# EAGLE design VFD PSU V2 (EAGLE 9.4.1)
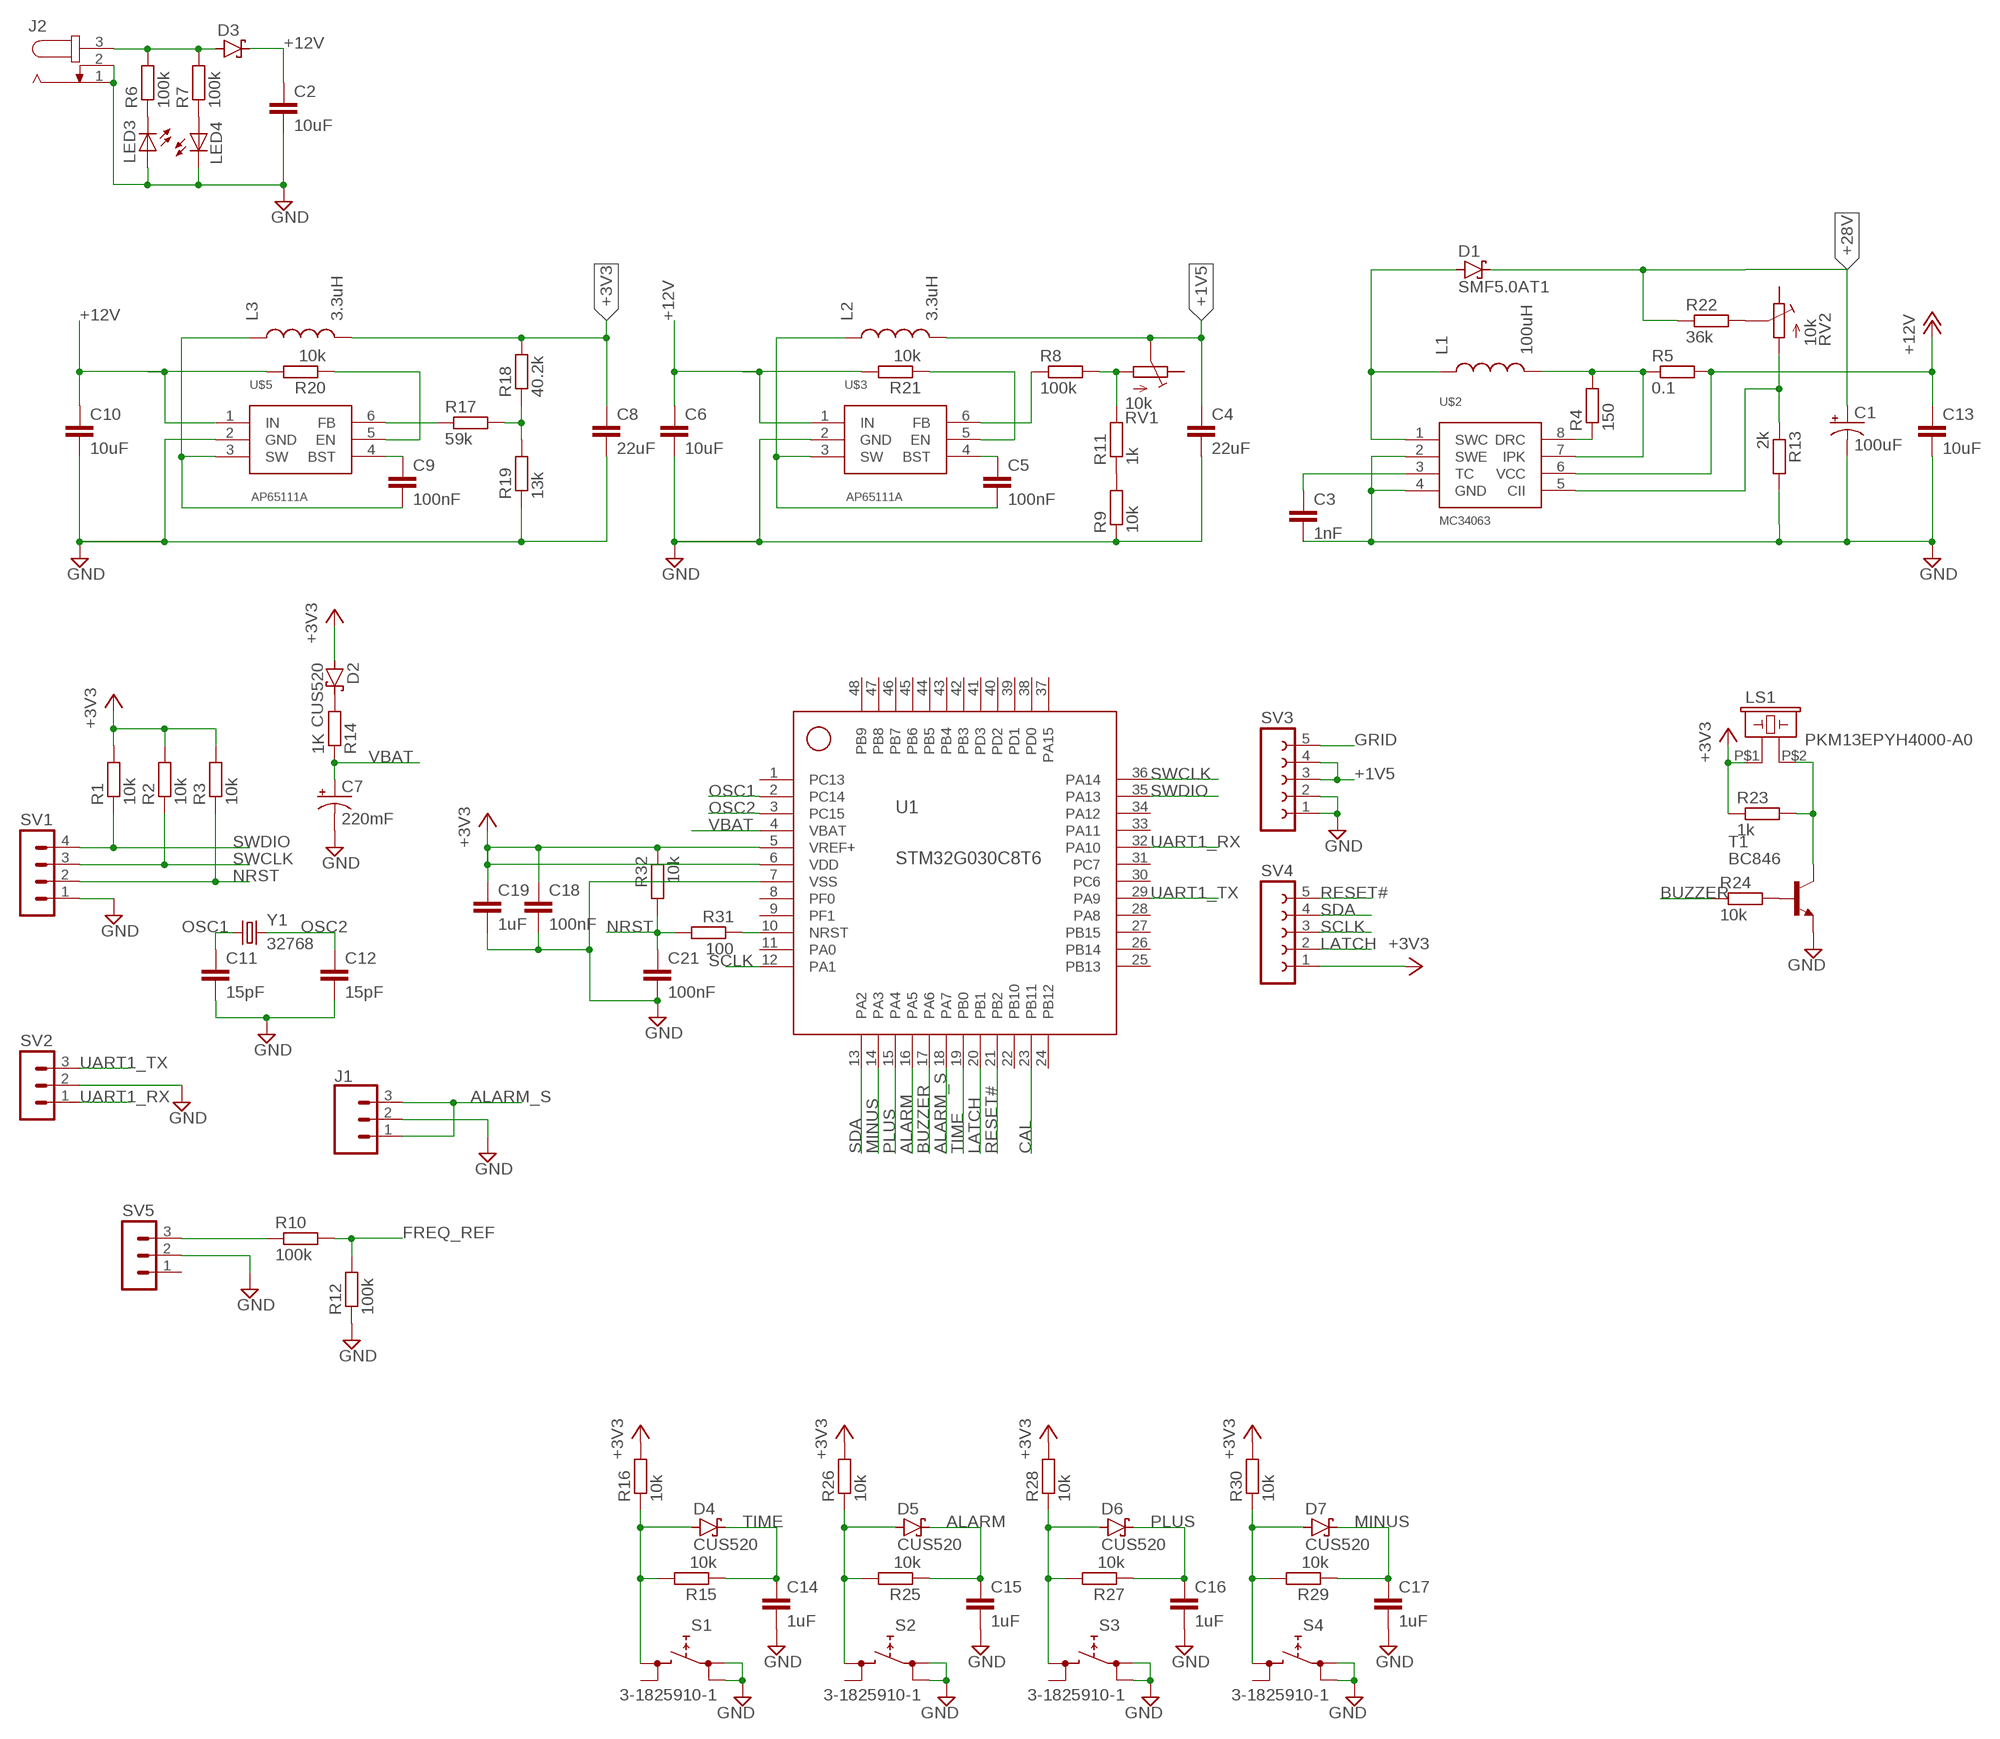
[diagram p0: schematic, sheet 1]

## Parts
C1  100uF  22UF-POLAR-PANASONIC_C-35V-20%  [PANASONIC_C]
C2  10uF  C-EUC0805  [C0805]
C3  1nF  C-EUC0603  [C0603]
C4  22uF  C-EUC0805  [C0805]
C5  100nF  C-EUC0603  [C0603]
C6  10uF  C-EUC0805  [C0805]
C7  220mF  DSK-3R3H224U-HL  [4.8-COINCELL-SCAP]
C8  22uF  C-EUC0805  [C0805]
C9  100nF  C-EUC0603  [C0603]
C10  10uF  C-EUC0805  [C0805]
C11  15pF  C-EUC0402  [C0402]
C12  15pF  C-EUC0402  [C0402]
C13  10uF  C-EUC0805  [C0805]
C14  1uF  C-EUC0603  [C0603]
C15  1uF  C-EUC0603  [C0603]
C16  1uF  C-EUC0603  [C0603]
C17  1uF  C-EUC0603  [C0603]
C18  100nF  C-EUC0603  [C0603]
C19  1uF  C-EUC0603  [C0603]
C21  100nF  C-EUC0603  [C0603]
D1  SMF5.0AT1  [SOD123FL]
D2  CUS520  BAT60J  [SOD323_ST]
D3  SCHOTTKY-DIODESMD  [SMB]
D4  CUS520  BAT60J  [SOD323_ST]
D5  CUS520  BAT60J  [SOD323_ST]
D6  CUS520  BAT60J  [SOD323_ST]
D7  CUS520  BAT60J  [SOD323_ST]
J1  CONN_03JST-PTH-NS  [JST-3-PTH-NS]
J2  JACK-PLUG0  [SPC4077]
L1  100uH  ETQ-P5M101YGK  [2-SMD]
L2  3.3uH  L1008  [1008]
L3  3.3uH  L1008  [1008]
LED3  LEDSMT1206  [1206]
LED4  LEDSMT1206  [1206]
LS1  PKM13EPYH4000-A0  [PKM13EPYH4000-A0]
R1  10k  R-EU_R0603  [R0603]
R2  10k  R-EU_R0603  [R0603]
R3  10k  R-EU_R0603  [R0603]
R4  150  R-EU_R0603  [R0603]
R5  0.1  R-EU_R0805  [R0805]
R6  100k  R-EU_R0603  [R0603]
R7  100k  R-EU_R0603  [R0603]
R8  100k  R-EU_R0603  [R0603]
R9  10k  R-EU_R0603  [R0603]
R10  100k  R-EU_R0603  [R0603]
R11  1k  R-EU_R0603  [R0603]
R12  100k  R-EU_R0603  [R0603]
R13  2k  R-EU_R0603  [R0603]
R14  1K  R-EU_R0603  [R0603]
R15  10k  R-EU_R0603  [R0603]
R16  10k  R-EU_R0603  [R0603]
R17  59k  R-EU_R0603  [R0603]
R18  40.2k  R-EU_R0603  [R0603]
R19  13k  R-EU_R0603  [R0603]
R20  10k  R-EU_R0603  [R0603]
R21  10k  R-EU_R0603  [R0603]
R22  36k  R-EU_R0603  [R0603]
R23  1k  R-EU_R0603  [R0603]
R24  10k  R-EU_R0603  [R0603]
R25  10k  R-EU_R0603  [R0603]
R26  10k  R-EU_R0603  [R0603]
R27  10k  R-EU_R0603  [R0603]
R28  10k  R-EU_R0603  [R0603]
R29  10k  R-EU_R0603  [R0603]
R30  10k  R-EU_R0603  [R0603]
R31  100  R-EU_R0603  [R0603]
R32  10k  R-EU_R0603  [R0603]
RV1  10k  TC33X-2  [TC33X-2]
RV2  10k  TC33X-2  [TC33X-2]
S1  3-1825910-1  PANASONICSWITCH  [PANASONISWITCH]
S2  3-1825910-1  PANASONICSWITCH  [PANASONISWITCH]
S3  3-1825910-1  PANASONICSWITCH  [PANASONISWITCH]
S4  3-1825910-1  PANASONICSWITCH  [PANASONISWITCH]
SV1  MA04-1  [MA04-1]
SV2  MA03-1  [MA03-1]
SV3  FE05W  [FE05W]
SV4  FE05W  [FE05W]
SV5  MA03-1  [MA03-1]
T1  BC846  [SOT23]
U1  STM32G030C8T6  [LQFP48]
U$2  MC34063  [SO08]
U$3  AP65111A  [TSOT23-6]
U$5  AP65111A  [TSOT23-6]
Y1  32768  FC-135  [2-SMD-NO-LEAD-Q]

## Nets
+1V5: C4.1 L2.P$2 RV1.P$2(S) SV3.3 SV3.4
+3V3: C8.1 C18.1 C19.1 D2.A L3.P$2 LS1.P$1 R1.2 R2.2 R3.2 R16.2 R18.2 R23.1 R26.2 R28.2 R30.2 R32.1 SV4.1 U1.5(VREF+) U1.6(VDD)
+12V: C2.1 C6.1 C10.1 C13.1 D3.C R5.2 R20.2 R21.2 U$2.6(VCC) U$3.1(IN) U$5.1(IN)
+28V: C1.+ D1.C R22.1
ALARM: C15.1 D5.C R25.1 U1.16(PA5)
ALARM_S: J1.1 J1.3 U1.18(PA7)
BUZZER: R24.1 U1.17(PA6)
CAL: U1.23(PB11)
FREQ_REF: R10.2 R12.2
GND: C1.- C2.2 C3.2 C4.2 C6.2 C7.P$2(-) C8.2 C10.2 C11.2 C12.2 C13.2 C14.2 C15.2 C16.2 C17.2 C18.2 C19.2 C21.2 J1.2 J2.1 J2.2 LED3.A LED4.C R9.1 R12.1 R13.2 R19.1 S1.P$1 S1.P$2 S2.P$1 S2.P$2 S3.P$1 S3.P$2 S4.P$1 S4.P$2 SV1.1 SV2.2 SV3.1 SV3.2 SV5.2 T1.2(E) U1.7(VSS) U$2.2(SWE) U$2.4(GND) U$3.2(GND) U$5.2(GND)
GRID: SV3.5
LATCH: SV4.2 U1.20(PB1)
MINUS: C17.1 D7.C R29.1 U1.14(PA3)
N$1: LED3.C R6.1
N$2: LED4.A R7.1
N$3: R9.2 R11.1
N$4: R8.1 U$3.6(FB)
N$5: L1.P$2 R4.2 R5.1 U$2.7(IPK)
N$6: D3.A J2.3 R6.2 R7.2
N$7: R4.1 U$2.8(DRC)
N$8: R21.1 U$3.5(EN)
N$9: C5.2 L2.P$1 U$3.3(SW)
N$10: C5.1 U$3.4(BST)
N$11: R8.2 R11.2 RV1.P$1(E)
N$12: D1.A L1.P$1 U$2.1(SWC)
N$13: R22.2 RV2.P$2(S)
N$14: C3.1 U$2.3(TC)
N$15: R10.1 SV5.3
N$16: R20.1 U$5.5(EN)
N$17: C9.2 L3.P$1 U$5.3(SW)
N$18: C9.1 U$5.4(BST)
N$19: D4.A R15.2 R16.1 S1.P$3
N$20: R17.1 U$5.6(FB)
N$21: R17.2 R18.1 R19.2
N$22: R13.1 RV2.P$1(E) U$2.5(CII)
N$23: D2.C R14.2
N$25: LS1.P$2 R23.2 T1.3(C)
N$26: R24.2 T1.1(B)
N$27: D5.A R25.2 R26.1 S2.P$3
N$28: R31.1 U1.10(NRST)
N$29: D6.A R27.2 R28.1 S3.P$3
N$31: D7.A R29.2 R30.1 S4.P$3
NRST: C21.1 R3.1 R31.2 R32.2 SV1.2
OSC1: C11.1 U1.2(PC14) Y1.P$1
OSC2: C12.1 U1.3(PC15) Y1.P$2
PLUS: C16.1 D6.C R27.1 U1.15(PA4)
RESET#: SV4.5 U1.21(PB2)
SCLK: SV4.3 U1.12(PA1)
SDA: SV4.4 U1.13(PA2)
SWCLK: R2.1 SV1.3 U1.36(PA14)
SWDIO: R1.1 SV1.4 U1.35(PA13)
TIME: C14.1 D4.C R15.1 U1.19(PB0)
UART1_RX: SV2.1 U1.32(PA10)
UART1_TX: SV2.3 U1.29(PA9)
VBAT: C7.P$1(+) R14.1 U1.4(VBAT)
Unconnected: RV1.P$3(A) RV2.P$3(A) S1.P$4 S2.P$4 S3.P$4 S4.P$4 SV5.1 U1.1(PC13) U1.8(PF0) U1.9(PF1) U1.11(PA0) U1.22(PB10) U1.24(PB12) U1.25(PB13) U1.26(PB14) U1.27(PB15) U1.28(PA8) U1.30(PC6) U1.31(PC7) U1.33(PA11) U1.34(PA12) U1.37(PA15) U1.38(PD0) U1.39(PD1) U1.40(PD2) U1.41(PD3) U1.42(PB3) U1.43(PB4) U1.44(PB5) U1.45(PB6) U1.46(PB7) U1.47(PB8) U1.48(PB9)

## Library data of the parts
C1 = SparkFun-Capacitors:22UF-POLAR: 22µF polarized capacitors A capacitor is a passive two-terminal electrical component used to store electrical energy temporarily in an electric field.; PROD_ID: CAP-08618; VALUE: 22uF
C2-C6 C8-C10 C13-C19 C21 = rcl:C-EU: CAPACITOR, European symbol; SPICEPREFIX: C
C7 = Mason-Passives:DSK-3R3H224U-HL: A 220mF coin cell super capacitor, rated at 3.3v
C11 C12 = resistor:C-EU: CAPACITOR, European symbol
D1 = diode:SMF5.0AT1: 200 W Transient Voltage Suppressor Source: Data sheet <http://www.onsemi.com/pub_link/Collateral/SMF5.0AT1-D.PDF>
D2 D4-D7 = diode:BAT60J: Schottky barrier diode Source: www.st.com, BAT60J.pdf
D3 = diode:SCHOTTKY-DIODE: Schottky Diode
J1 = SparkFun-Connectors:CONN_03: Multi connection point. Often used as Generic Header-pin footprint for 0.1 inch spaced/style header connections On any of the 0.1 inch spaced packages, you can populate with these: Break Away Headers - Straight <https://www.sparkfun.com/products/116> (PRT-00116) Break Away Male Headers - Right Angle <https://www.sparkfun.com/products/553> (PRT-00553) Female Headers <https://www.sparkfun.com/products/115> (PRT-00115) Break Away Headers - Machine Pin <https://www.sparkfun.com/products/117> (PRT-00117) Break Away Female Headers - Swiss Machine Pin <https://www.sparkfun.com/products/743> (PRT-00743) Stackable Header - 3 Pin (Female, 0.1") <https://www.sparkfun.com/products/13875> (PRT-13875) For SCREWTERMINALS and SPRING TERMINALS visit here: Screw Terimnals on SparkFun.com <https://www.sparkfun.com/search/results?term=Screw+Terminals> (5mm/3.5mm/2.54mm spacing) This device is also useful as a general connection point to wire up your design to another part of your project. Our various solder wires solder well into these plated through hole pads. Hook-Up Wire - Assortment (Stranded, 22 AWG) <https://www.sparkfun.com/products/11375> (PRT-11375) Hook-Up Wire - Assortment (Solid Core, 22 AWG) <https://www.sparkfun.com/products/11367> (PRT-11367) View the entire wire category on our website here <https://www.sparkfun.com/categories/141> Special notes: Molex polarized connector foot print use with SKU : PRT-08232 with associated crimp pins and housings.
J2 = con-jack:JACK-PLUG: DC POWER JACK Power Jack, DC, Right Angle, Through Hole, Rated 5A at 16VDC, PC Terminals Distributor: Farnell (www.Farnell.de) Drawing: 84N1161.pdf / 84N1162.pdf Manufacturer: SPC Technology (www.spctechnology.com) Type: SPC4077 / SPC 4078; OC_FARNELL: unknown; OC_NEWARK: unknown
L1 = Mason-Passives:ETQ-P5M101YGK: 100uH j-lead surface mount inductor manufactured by panasonic
L2 = VFD:L1008
L3 = Mason-Passives:L1008
LED3 LED4 = led:LED: LED OSRAM: - CHIPLED LG R971, LG N971, LY N971, LG Q971, LY Q971, LO R971, LY R971 LH N974, LH R974 LS Q976, LO Q976, LY Q976 LO Q996 - Hyper CHIPLED LW Q18S LB Q993, LB Q99A, LB R99A - SideLED LS A670, LO A670, LY A670, LG A670, LP A670 LB A673, LV A673, LT A673, LW A673 LH A674 LY A675 LS A676, LA A676, LO A676, LY A676, LW A676 LS A679, LY A679, LG A679 - Hyper Micro SIDELED® LS Y876, LA Y876, LO Y876, LY Y876 LT Y87S - SmartLED LW L88C, LW L88S LB L89C, LB L89S, LG L890 LS L89K, LO L89K, LY L89K LS L896, LA L896, LO L896, LY L896 - TOPLED LS T670, LO T670, LY T670, LG T670, LP T670 LSG T670, LSP T670, LSY T670, LOP T670, LYG T670 LG T671, LOG T671, LSG T671 LB T673, LV T673, LT T673, LW T673 LH T674 LS T676, LA T676, LO T676, LY T676, LB T676, LH T676, LSB T676, LW T676 LB T67C, LV T67C, LT T67C, LS T67K, LO T67K, LY T67K, LW E67C LS E67B, LA E67B, LO E67B, LY E67B, LB E67C, LV E67C, LT E67C LW T67C LS T679, LY T679, LG T679 LS T770, LO T770, LY T770, LG T770, LP T770 LB T773, LV T773, LT T773, LW T773 LH T774 LS E675, LA E675, LY E675, LS T675 LS T776, LA T776, LO T776, LY T776, LB T776 LHGB T686 LT T68C, LB T68C - Hyper Mini TOPLED® LB M676 - Mini TOPLED Santana® LG M470 LS M47K, LO M47K, LY M47K Source: http://www.osram.convergy.de LUXEON: - LUMILED® LXK2-PW12-R00, LXK2-PW12-S00, LXK2-PW14-U00, LXK2-PW14-V00 LXK2-PM12-R00, LXK2-PM12-S00, LXK2-PM14-U00 LXK2-PE12-Q00, LXK2-PE12-R00, LXK2-PE12-S00, LXK2-PE14-T00, LXK2-PE14-U00 LXK2-PB12-K00, LXK2-PB12-L00, LXK2-PB12-M00, LXK2-PB14-N00, LXK2-PB14-P00, LXK2-PB14-Q00 LXK2-PR12-L00, LXK2-PR12-M00, LXK2-PR14-Q00, LXK2-PR14-R00 LXK2-PD12-Q00, LXK2-PD12-R00, LXK2-PD12-S00 LXK2-PH12-R00, LXK2-PH12-S00 LXK2-PL12-P00, LXK2-PL12-Q00, LXK2-PL12-R00 Source: www.luxeon.com KINGBRIGHT: KA-3528ASYC Source: www.kingbright.com
LS1 = Mason-Misc:PKM13EPYH4000-A0
R1-R4 R6-R32 = resistor:R-EU_: RESISTOR, European symbol
R5 = rcl:R-EU_: RESISTOR, European symbol; SPICEPREFIX: R
RV1 RV2 = Mason-Passives:TC33X-2
S1-S4 = Mason-Misc:PANASONICSWITCH
SV1 = con-lstb:MA04-1: PIN HEADER; OC_FARNELL: unknown; OC_NEWARK: unknown
SV2 SV5 = con-lstb:MA03-1: PIN HEADER; OC_FARNELL: unknown; OC_NEWARK: unknown
SV3 SV4 = con-lsta:FE05W: FEMALE HEADER; OC_FARNELL: unknown; OC_NEWARK: unknown
T1 = transistor:BC846: NPN TRANSISTOR
U1 = Mason-MCUs:STM32G030C8T6: A 32 bit STM microcontroller with integrated RTC
U$2 = Mason-Power:MC34063
U$3 = VFD:AP65111A: 18v 1.5A max buck converter manufactured by Diodes Incorporated
U$5 = Mason-Power:AP65111A: 18v 1.5A max buck converter manufactured by Diodes Incorporated
Y1 = Mason-Passives:FC-135: An Epson 2-SMD 20ppm quartz crystal

## Board
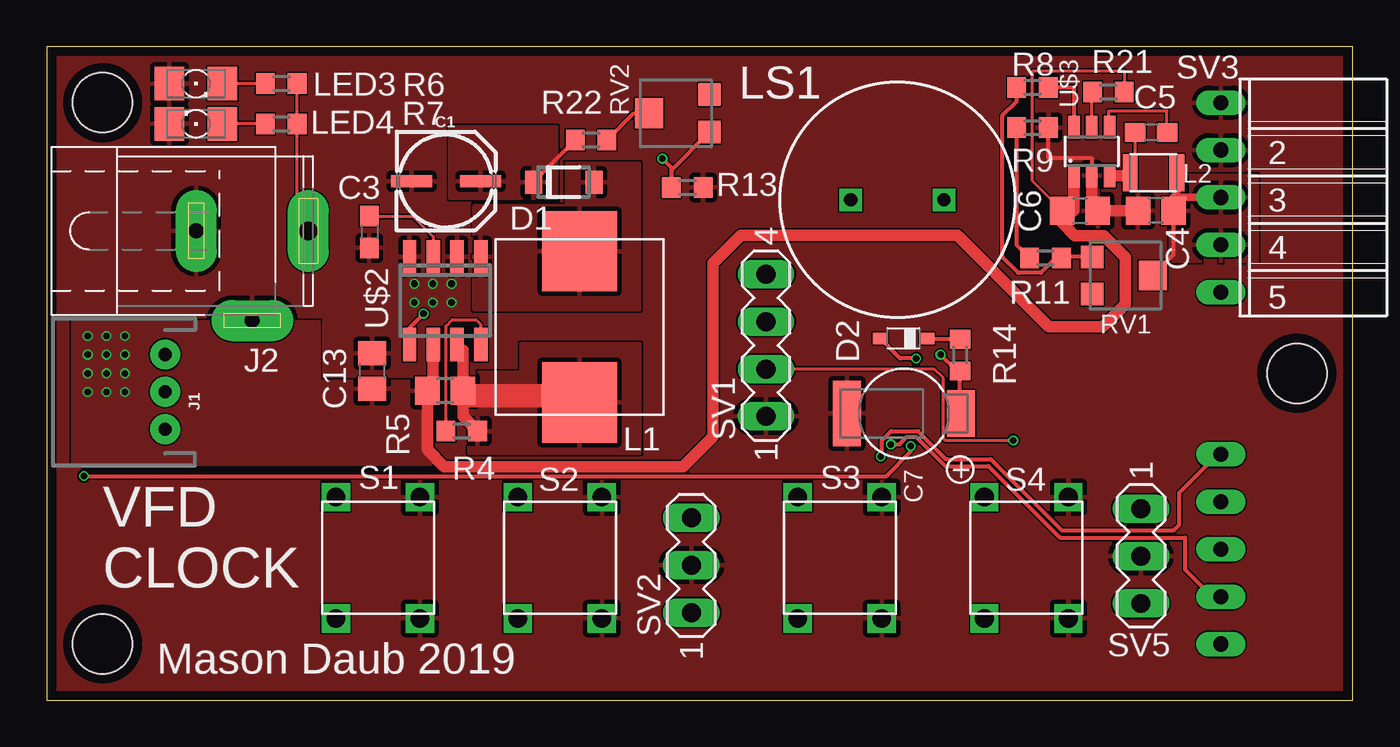
[diagram p1: board, top side]
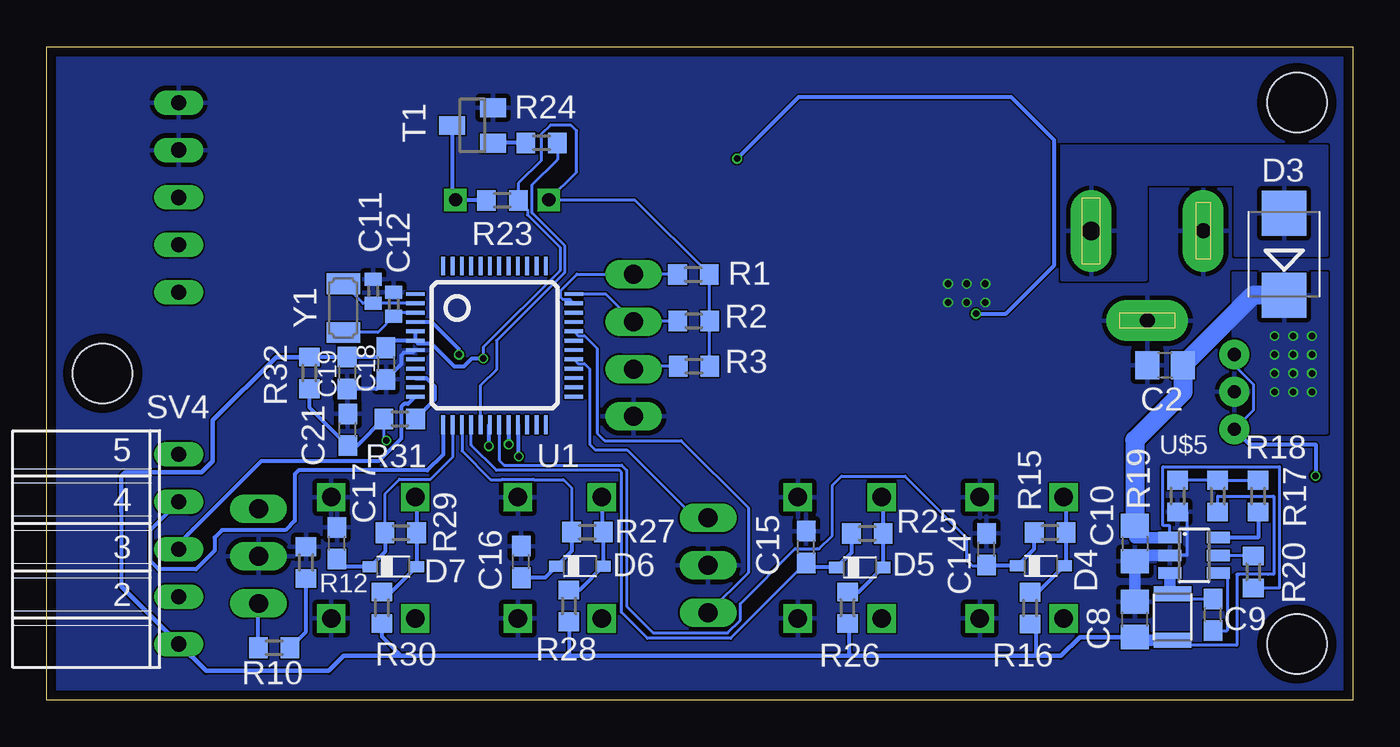
[diagram p2: board, bottom side, seen from below]

Size 70 x 35 mm. Coordinates in mm from the lower left corner, seen from the top.
Outline: 0,0 70,0 70,35 0,35 0,0
Copper layers (1*16): Top 0.035mm / dielectric 1.5mm / Bottom 0.035mm
Design rules "jlcpcb": minimum track width 3.5mil, minimum drill 0.35mm, track to track 3.5mil, track to pad 3.5mil, pad to pad 3.5mil, via to via 5mil, smd to smd 3.5mil, copper to edge 20mil, drill to drill 6mil, minimum pad ring 10mil, minimum via ring 3mil, stop-mask expansion 4mil, vias tented up to drill 0mil, thermal gap 10mil
Holes 3.2 mm at 3,32 3,3 67,17.5

### Footprints (pad centres in the part's own frame; a part is rotated, then mirrored left to right if it is on the bottom)
PANASONIC_C = smd 2.2 x 0.65: + 1.9,-0.2; - -1.8,-0.2
C0805 = smd 1.3 x 1.5: 1 -0.95,0; 2 0.95,0
C0603 = smd 1.1 x 1: 1 -0.85,0; 2 0.85,0
4.8-COINCELL-SCAP = smd 2.5 x 1.5: P$1 0,3.05 | smd 3.5 x 1.5: P$2 0,-3.05
C0402 = smd 0.7 x 0.9: 1 -0.65,0; 2 0.65,0
SOD123FL = smd 0.91 x 1.22: A 1.625,0; C -1.625,0
SOD323_ST = smd 0.8 x 0.6: A 1.25,0; C -1.25,0
SMB = smd 2.4 x 2.4: A 2.2,0; C -2.2,0
JST-3-PTH-NS = drill 0.7 pad 1.6: 1 -2,0; 2 0,0; 3 2,0
SPC4077 = drill 0.8 pad 2.184 long: 1 -3,0; 2 0,-4.8 | drill 1 pad 2.184 long: 3 3,0
2-SMD = smd 4.3 x 4: P$1 -4.05,0; P$2 4.05,0
1008 = smd 0.8 x 2: P$1 -1.25,0; P$2 1.25,0
1206 = smd 1.6 x 1.803: A -1.422,0; C 1.422,0
PKM13EPYH4000-A0 = drill 0.7 square: P$1 -2.5,0; P$2 2.5,0
R0603 = smd 1 x 1.1: 1 -0.85,0; 2 0.85,0
R0805 = smd 1.3 x 1.5: 1 -0.95,0; 2 0.95,0
TC33X-2 = smd 1.2 x 1.2: P$1 -1,-1.8; P$3 1,-1.8 | smd 1.6 x 1.5: P$2 0,1.45
PANASONISWITCH = drill 1 square: P$1 2.25,3.25; P$2 2.25,-3.25; P$3 -2.25,3.25; P$4 -2.25,-3.25
MA04-1 = drill 1.016 long: 1 -3.81,0; 2 -1.27,0; 3 1.27,0; 4 3.81,0
MA03-1 = drill 1.016 long: 1 -2.54,0; 2 0,0; 3 2.54,0
FE05W = drill 0.813 long: 1 -5.08,0; 2 -2.54,0; 3 0,0; 4 2.54,0; 5 5.08,0
SOT23 = smd 1 x 1.4: 1 -0.95,-1.1; 2 0.95,-1.1; 3 0,1.1
LQFP48 = smd 0.2 x 1: 1 -2.75,-4.25; 2 -2.25,-4.25; 3 -1.75,-4.25; 4 -1.25,-4.25; 5 -0.75,-4.25; 6 -0.25,-4.25; 7 0.25,-4.25; 8 0.75,-4.25; 9 1.25,-4.25; 10 1.75,-4.25; 11 2.25,-4.25; 12 2.75,-4.25; 25 2.75,4.25; 26 2.25,4.25; 27 1.75,4.25; 28 1.25,4.25; 29 0.75,4.25; 30 0.25,4.25; 31 -0.25,4.25; 32 -0.75,4.25; 33 -1.25,4.25; 34 -1.75,4.25; 35 -2.25,4.25; 36 -2.75,4.25 | smd 1 x 0.2: 13 4.25,-2.75; 14 4.25,-2.25; 15 4.25,-1.75; 16 4.25,-1.25; 17 4.25,-0.75; 18 4.25,-0.25; 19 4.25,0.25; 20 4.25,0.75; 21 4.25,1.25; 22 4.25,1.75; 23 4.25,2.25; 24 4.25,2.75; 37 -4.25,2.75; 38 -4.25,2.25; 39 -4.25,1.75; 40 -4.25,1.25; 41 -4.25,0.75; 42 -4.25,0.25; 43 -4.25,-0.25; 44 -4.25,-0.75; 45 -4.25,-1.25; 46 -4.25,-1.75; 47 -4.25,-2.25; 48 -4.25,-2.75
SO08 = smd 0.72 x 1.78: 1 -1.905,-2.35; 2 -0.635,-2.35; 3 0.635,-2.35; 4 1.905,-2.35; 5 1.905,2.35; 6 0.635,2.35; 7 -0.635,2.35; 8 -1.905,2.35
TSOT23-6 = smd 0.62 x 1.22: 1 -0.95,-1.3; 2 0,-1.3; 3 0.95,-1.3; 4 0.95,1.3; 5 0,1.3; 6 -0.95,1.3
2-SMD-NO-LEAD-Q = smd 1.1 x 1.8: P$1 -1.3,0; P$2 1.3,0

### Placement (x,y rotation side)
C1  21.36,28 0 top
C2  10.06,17.92 180 bottom
C3  17.29,25.07 270 top
C4  59.44,26.21 180 top
C5  59.19,30.41 180 top
C6  55.38,26.21 0 top
C7  45.95,15.35 270 top
C8  11.68,4.32 90 bottom
C9  7.49,4.57 90 bottom
C10  11.68,8.38 270 bottom
C11  52.5,21.9 90 bottom
C12  51.4,21.2 90 bottom
C13  17.45,17.62 90 top
C14  19.63,8.08 90 bottom
C15  29.3,8.2 90 bottom
C16  44.57,7.4 90 bottom
C17  54.44,8.4 90 bottom
C18  51.82,18.02 270 bottom
C19  53.9,17.52 270 bottom
C21  53.86,14.48 90 bottom
D1  27.71,27.74 0 top
D2  45.92,19.37 180 top
D3  3.68,23.88 90 bottom
D4  16.72,7.19 0 bottom
D5  26.42,7.1 0 bottom
D6  41.42,7.17 0 bottom
D7  51.42,7.14 0 bottom
J1  6.35,16.51 90 top
J2  11.02,25.13 0 top
L1  28.56,19.99 270 top
L2  59.31,28.25 0 top
L3  9.65,4.45 270 bottom
LED3  8,33.02 0 top
LED4  8,30.86 180 top
LS1  45.59,26.79 0 top
R1  35.34,22.8 0 bottom
R2  35.32,20.3 0 bottom
R3  35.31,17.88 0 bottom
R4  22.25,14.41 0 top
R5  21.36,16.57 180 top
R6  12.57,33.02 0 top
R7  12.57,30.86 0 top
R8  52.84,32.82 180 top
R9  52.84,30.66 180 top
R10  57.81,2.8 0 bottom
R11  53.53,23.68 0 top
R12  56.1,7.36 270 bottom
R13  34.33,27.46 0 top
R14  48.95,18.48 90 top
R15  16.22,8.97 0 bottom
R16  17.29,4.92 270 bottom
R17  5.08,10.92 90 bottom
R18  7.24,10.92 270 bottom
R19  9.4,10.92 90 bottom
R20  5.33,6.86 270 bottom
R21  56.9,32.56 0 top
R22  29.17,30 0 top
R23  45.58,26.77 180 bottom
R24  43.48,29.85 180 bottom
R25  26.02,8.92 0 bottom
R26  27.08,4.94 270 bottom
R27  41.02,8.99 0 bottom
R28  42.01,5.04 270 bottom
R29  51.02,8.96 0 bottom
R30  52.04,4.94 270 bottom
R31  51.08,15.06 180 bottom
R32  55.92,17.52 270 bottom
RV1  57.82,22.74 270 top
RV2  33.72,31.43 90 top
S1  17.75,7.62 0 top
S2  27.5,7.62 0 top
S3  42.5,7.62 0 top
S4  52.5,7.62 0 top
SV1  38.55,19 90 top
SV2  34.55,7.22 90 top
SV3  62.92,26.92 270 top
SV4  62.92,8.08 90 bottom
SV5  58.65,7.71 270 top
T1  47.18,30.78 90 bottom
U1  46,19 270 bottom
U$2  21.36,21.39 180 top
U$3  56.01,29.39 0 top
U$5  8.51,7.75 270 bottom
Y1  54.1,21 270 bottom

### Tracks (layer width: path | path; a pad name or v marks a point on that pad's centre or on a via)
+1V5
  Top 0.203: C4.1 60.39,23.86 RV1.P$2
  Top 0.406: L2.P$2 60.56,26.21 C4.1 60.39,26.92 SV3.3
  Top 0.61: C4.1 60.56,26.21
  pour Top: 64.9,28.1 60.6,28.1 60.2,28.1 60.2,23.5 64.9,23.5
+3V3  (via drill 0.35)
  Top 0.203: v46.6,18.3 45.74,18.3 D2.A
  Bottom 0.152: 6.11,6.74 4.55,6.74 4.55,6.73 4.24,6.73 4.24,10.92 7.24,10.92 R18.2 | 6.11,6.74 | R3.2 R2.2 34.47,22.78 R1.2 38.46,26.77 43.11,26.77 | LS1.P$1 41.6,28.28 41.6,30.5 41.9,30.8 43,30.8 43.5,30.3 43.5,28.9 44.73,27.67 R23.1 44.23,26.27 44.23,25.99 42.5,24.26 42.5,23 46.6,18.9 v46.6,18.3 | C8.1 11.68,3.19 | L3.P$2 9.38,2.92 6.22,2.92 6.22,6.73 6.11,6.73 6.11,6.74
  Bottom 0.203: U1.5 U1.6 | U1.6 51.44,19.25 C18.1 52.32,18.37 C19.1 R32.1 | 43.11,26.77 LS1.P$1 | R16.2 17,3.78 17,2.36 | R26.2 27,4.01 27,2.36 | R28.2 42,2.36 | R30.2 52.04,3.4 51,2.36 | U1.6 50.11,19.11 49.4,19.11 48.16,17.87 47.64,17.87 47.2,18.3 v46.6,18.3 | 66,10.08 66,6.1
  Bottom 0.254: C8.1 14.63,3.37 15.64,2.36 17,2.36 27,2.36 42,2.36 51,2.36 54.08,2.36 54.88,1.56 61.46,1.56 62.95,3.05 | R32.1 57.71,18.37 61.1,14.98 61.1,12.8 61.7,12.2 65.8,12.2 66,12 66,10.08 | 62.95,3.05 66,6.1 | SV4.1 62.92,3.02 62.95,3.05
  Bottom 0.61: 11.68,3.19 L3.P$2
+12V  (via drill 0.35)
  Top 0.152: C6.1 52.84,27.8 52.84,33.71 57.75,33.71 R21.2 | R5.2 20.72,16.88
  Top 0.61: U$3.1 55.06,26.21 C6.1 54.42,25.56 55.11,24.87 56.65,24.87 57.8,23.72 57.8,21.2 56.6,20 53.7,20 48.8,24.9 37.2,24.9 35.7,23.4 35.7,14.1 34.1,12.5 21.3,12.5 20.41,13.39 R5.2 | 20.72,16.88 U$2.6
  Bottom 0.152: 4.92,6.01 3.94,6.01 3.94,12.5 10.18,12.5 10.18,9.34 9.81,9.34 U$5.1 | 11.68,8.7 C10.1
  Bottom 0.203: R20.2 4.92,6.01
  Bottom 0.61: U$5.1 11.68,8.7
  Bottom 1.016: D3.C 5.36,21.68 C2.1 9.11,16.49 11.68,13.92 C10.1
  other vias: 2.2,19.5 3.2,19.5 4.2,19.5 2.2,18.5 3.2,18.5 4.2,18.5 4.2,17.5 3.2,17.5 2.2,17.5 4.2,16.5 3.2,16.5 2.2,16.5
  pour Top: 19.45,17.07 15.64,17.07 15.64,12.63 20.59,12.63 20.59,15.68
  pour Bottom: 6.4,22.9 1.4,22.9 1.4,14.3 6.4,14.3
  pour Top: 1.4,20.3 14.6,20.3 14.6,17.1 16.5,17.1 16.5,12.6 16.3,12.6 1.4,12.6
+28V
  Top 0.203: R22.1 26.08,27.76 D1.C
  pour Top: 26.82,26.85 21.61,26.85 21.61,28.88 21.61,30.73 23.5,30.73 27.33,30.73 27.33,26.85
ALARM
  Bottom 0.152: C15.1 33.35,3.3 37.8,3.3 39.2,4.7 39.2,12.2 39.3,12.3 45.9,12.3 47.25,13.65 U1.16
  Bottom 0.203: R25.1 26.87,7.9 D5.C 29.05,7.1 C15.1
ALARM_S  (via drill 0.35)
  Top 0.203: v2,12 45,12 46.3,13.3 v46.3,13.6
  Bottom 0.152: J1.3 6.35,17.93 5.35,16.93 5.35,15.51 J1.1
  Bottom 0.203: J1.1 5.54,13.7 2,13.7 v2,12 | v46.3,13.6 46.3,14.7 U1.18
BUZZER
  Bottom 0.152: U1.17 46.75,16.85 45.9,17.7 45.9,19.26 42.26,22.9 42.26,24.36 43.99,26.09 43.99,27.59 42.63,28.95 R24.1
FREQ_REF
  Bottom 0.203: R10.2 56.1,3.66 R12.2
GND  (via drill 0.35)
  Top 0.203: 56.01,27.74 56.01,29.01 53.69,29.01 R9.1
  Top 0.61: U$3.2 56.01,27.74 56.01,26.21 C6.2 C4.2
  Bottom 0.152: 8.89,10.07 8.89,7.75 10.16,7.75
  Bottom 0.203: U1.7 50.4,18.6 50.85,18.6 51,18.45 51,18 C18.2 52.32,16.67 C19.2
  Bottom 0.61: 11.68,7.75 10.16,7.75 | C10.2 C8.2
  other vias: 19.7,22.3 20.7,22.3 21.7,22.3 21.7,21.3 20.7,21.3 19.7,21.3
  pour Top: 20.85,28.38 20.85,27.11 22.37,25.58 22.37,21.64 22.25,21.52 20.09,21.52 18.69,20.12 18.69,17.71 15.37,17.71 15.37,28.38
  pour Top (rank 2): 0,35 70,35 70,-0.1 0.1,-0.1 0,-0.1
  pour Bottom (rank 2): 0,35 70,35 70,0 0,0
LATCH  (via drill 0.35)
  Top 0.203: v45.24,13.7 45.7,13.7 46.1,14.09 46.59,14.09 48.16,12.53 50.47,12.53 54.3,8.7 61,8.7 61,7 62.46,5.54 SV4.2
  Bottom 0.203: U1.20 v45.25,13.71 v45.24,13.7
MINUS
  Bottom 0.152: U1.14 48.25,13 49.42,11.83 51.09,11.83 51.87,11.04 R29.1
  Bottom 0.203: C17.1 54.03,7.14 D7.C 51.87,7.94 R29.1
N$1
  Top 0.152: R6.1 LED3.C
N$2
  Top 0.152: R7.1 LED4.A
N$3
  Top 0.203: R11.1 51.98,24.38 R9.2
N$4
  Top 0.203: R8.1 55.06,32.82 U$3.6
N$5
  Top 0.152: U$2.7 22.31,18.73
  Top 0.61: R4.2 22.31,15.2 22.31,16.31 22.31,18.73
  Top 1.27: 28.99,16.31 22.31,16.31
  pour Top: 22.63,17.58 25.44,17.58 25.44,19.12 31.79,19.12 31.79,13.2 22.63,13.2
N$6
  Top 0.152: J2.3 13.42,25.73 R7.2 R6.2
  pour Bottom: 11.1,22.5 15.6,22.5 15.6,29.7 1.4,29.7 1.4,23.8 6.3,23.8 6.3,27.6 11.1,27.6
N$7
  Top 0.152: R4.1 21.4,20.03 21.74,20.38 23.01,20.38 23.26,20.12 U$2.8
N$8
  Top 0.152: U$3.5 56.01,32.56 R21.1
N$9
  Top 0.152: L2.P$1 58.34,28.25 C5.2
  Top 0.61: U$3.3 58.06,28.09 L2.P$1
N$10
  Top 0.152: C5.1 60.03,31.55 56.9,31.55 56.9,30.69 U$3.4
N$11
  Top 0.203: RV1.P$1 54.44,23.74 R11.2 54.09,23.68 53.28,22.88 52.08,22.88 51.23,23.72 51.23,31.32 51.98,32.07 R8.2
N$12
  pour Top: 22.88,24.82 22.88,20.9 31.79,20.9 31.79,28.76 27.83,28.76 27.83,26.47 22.88,26.47
N$13
  Top 0.203: R22.2 31.45,31.43 RV2.P$2
N$14
  Top 0.152: C3.1 19.62,25.92 20.72,24.82 U$2.3
N$15
  Bottom 0.203: R10.1 SV5.3
N$16
  Bottom 0.152: U$5.5 5.4,7.75 5.37,7.75 | 5.37,7.75 5.33,7.75 | R20.1 5.37,7.75
N$17
  Bottom 0.152: C9.2 9.65,5.42 L3.P$1
  Bottom 0.203: L3.P$1 9.81,5.7
  Bottom 0.61: 9.81,5.7 U$5.3
N$18
  Bottom 0.152: C9.1 6.73,3.72 6.73,6.86
  Bottom 0.203: U$5.4 6.79,6.8 6.73,6.86
N$19
  Bottom 0.203: S1.P$3 15.37,10.74 R15.2 15.37,7.29 D4.A 16.89,5.77 R16.1
N$20
  Bottom 0.203: R17.1 5.08,8.7 U$5.6
N$21
  Bottom 0.152: R19.2 R18.1 R17.2
N$22  (via drill 0.35)
  Top 0.203: RV2.P$1 33.48,28.39 R13.1 33.48,28.52 v33,29 | U$2.5 19.45,19.95 v20.2,20.7
  Bottom 0.203: v33,29 29.7,32.3 18.3,32.3 16,30 16,23.3 18.6,20.7 v20.2,20.7
N$23
  Top 0.203: R14.2 47.21,19.33 D2.C
N$25
  Bottom 0.203: T1.3 48.28,26.98 LS1.P$2 48.07,26.77 R23.2
N$26
  Bottom 0.203: R24.2 46.06,29.85 T1.1
N$27
  Bottom 0.203: S2.P$3 25.17,10.79 R25.2 D5.A 26.48,5.79 R26.1
N$28
  Bottom 0.203: U1.10 49.65,17.25 49.2,16.8 49.2,16.09 R31.1
N$29
  Bottom 0.203: S3.P$3 40.25,9.07 R27.2 D6.A 41.45,5.89 R28.1
N$31
  Bottom 0.203: S4.P$3 50.17,10.79 R29.2 D7.A 51.52,5.79 R30.1
NRST  (via drill 0.35)
  Top 0.152: v51.8,13.9 49.84,13.9 49.83,13.9 48.17,13.9 48.05,14.02 48.05,17.25 47.57,17.73 46.85,17.73 46.84,17.72 46.36,17.72 46.35,17.73 SV1.2
  Bottom 0.152: R3.1 38.4,17.88 SV1.2 | R31.2 51.93,14.03 v51.8,13.9
  Bottom 0.203: R31.2 53.36,13.63 C21.1 55.92,15.69 R32.2
OSC1
  Bottom 0.152: U1.2 C11.1 53.05,21.25 Y1.P$1
OSC2
  Bottom 0.152: U1.3 51.2,20.75 C12.1 52.25,19.7 Y1.P$2
PLUS
  Bottom 0.152: U1.15 47.75,13.35 46.2,11.8 45.62,11.8 45.59,11.83 43.91,11.83 43.88,11.8 42.3,11.8 41.87,11.37 R27.1
  Bottom 0.203: R27.1 41.87,7.97 D6.C 43.29,6.55 C16.1
RESET#  (via drill 0.35)
  Top 0.152: 62.76,13.16 SV4.5
  Top 0.203: v44.7,13.04 44.75,13.1 44.75,13.9 45.25,14.4 46.7,14.4 48.2,12.9 50.6,12.9 54.4,9.1 60.4,9.1 60.7,9.4 60.7,11.1 61.4,11.8 62.76,13.16
  Bottom 0.203: U1.21 44.75,13.1 v44.7,13.04
SCLK
  Bottom 0.203: U1.12 50.64,15.86 50.84,15.86 51,15.7 51,14 52.2,12.8 58.5,12.8 62.15,9.15 62.42,8.88 62.92,8.38 SV4.3
SDA
  Bottom 0.203: U1.13 48.75,13.15 49.6,12.3 56.5,12.3 56.7,12.1 56.7,9.6 57.2,9.1 60.6,9.1 61,8.7 61,8 62,7 64,7 64.43,7.43 64.43,9.11 SV4.4
SWCLK
  Bottom 0.152: U1.36 40.03,21.75 SV1.3 38.52,20.3 R2.1
SWDIO
  Bottom 0.152: U1.35 41.95,21.45 42.33,21.45 42.45,21.57 42.45,21.93 41.58,22.81 38.7,22.81 SV1.4 R1.1
TIME
  Bottom 0.152: U1.19 45.75,12.85 45.48,12.58 39.18,12.58 38.92,12.32 38.92,5.02 37.5,3.6 33.5,3.6 32.82,4.28 32.82,5.17 29.88,8.1 28.72,8.1 28.71,8.1 28.6,8.1 27.9,8.8 27.9,11.5 27.4,12 24,12 20.7,8.7 20.7,7.5 20.4,7.2 19.6,7.2
  Bottom 0.203: C14.1 19.6,7.2 19.59,7.19 D4.C 17.07,8.09 R15.1
UART1_RX
  Bottom 0.152: U1.32 41.52,19.52 41.18,19.52 40.5,18.83 40.5,14.3 40.1,13.9 36,13.9 32.4,10.3 32.4,6.83 SV2.1
UART1_TX
  Bottom 0.152: U1.29 41.52,18.02 41.18,18.02 40.9,17.73 40.9,13.7 40.6,13.4 38.9,13.4 35.26,9.76 SV2.3
VBAT  (via drill 0.35)
  Top 0.203: C7.P$1 48.95,15.4 R14.1 48.77,17.63 v47.9,18.5
  Bottom 0.203: v47.9,18.5 47.9,18.8 49.35,20.25 U1.4

### Text on the board
tNames: VFD / CLOCK | Mason Daub 2019